# Altium project GanBasedSynchronousDCDCBuckConverter.PrjPcb
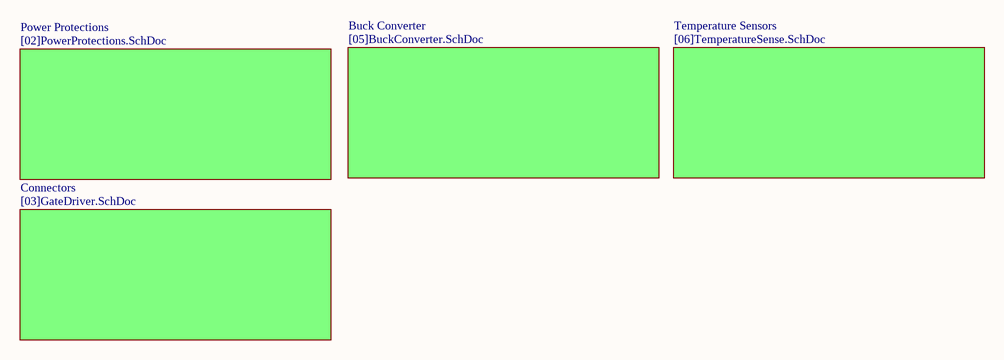
[diagram p0: [01]Main.SchDoc]
5 sheets, 56 parts. Net scope: flat (ports and power ports of the same name join across sheets).
Board file: BuckConverterDesign.PcbDoc
Sheets:
  [01]Main.SchDoc
    Power Protections = [02]PowerProtections.SchDoc
    Buck Converter = [05]BuckConverter.SchDoc
    Temperature Sensors = [06]TemperatureSense.SchDoc
    Connectors = [03]GateDriver.SchDoc

## Sheet [01]Main.SchDoc
size A4; SheetNumber: 1; SheetTotal: 5

### Sub-sheets
Buck Converter = [05]BuckConverter.SchDoc: no entries
Connectors = [03]GateDriver.SchDoc: no entries
Power Protections = [02]PowerProtections.SchDoc: no entries
Temperature Sensors = [06]TemperatureSense.SchDoc: no entries

### Notes on the sheet
- Title:
- Size:
- Date:
- A4
- Number:
- Time:
- Revision:
- Sheet
- of
- Project
- Drawn By :

## Sheet [02]PowerProtections.SchDoc
size A4; SheetNumber: 2; SheetTotal: 5
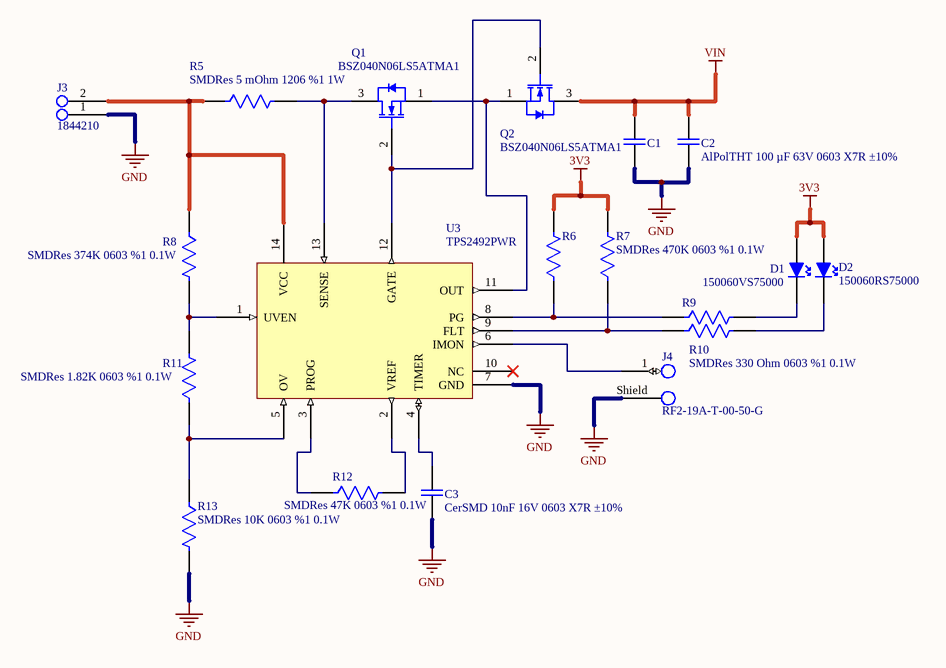
[diagram p1: [02]PowerProtections.SchDoc]

### Parts
C1  AlPolTHT 100 µF 63V 0603 X7R ±10%  [107AVG063MFBJ]  (value not drawn)
C2  AlPolTHT 100 µF 63V 0603 X7R ±10%  [107AVG063MFBJ]
C3  CerSMD 10nF 16V 0603 X7R ±10%  [CAPC1608X09N]
D1  150060VS75000  [LED1608X08N]
D2  150060RS75000  [LED1608X08N]
J3  1844210  [1844210]
J4  RF2-19A-T-00-50-G  [RF2-19A-T-00-50-G]
Q1  BSZ040N06LS5ATMA1  [PG-TSDSON-8-FL]
Q2  BSZ040N06LS5ATMA1  [PG-TSDSON-8-FL]
R5  SMDRes 5 mOhm 1206 %1 1W  [RESC3116X10N]
R6  SMDRes 470K 0603 %1 0.1W  [RESC1508X06N]  (value not drawn)
R7  SMDRes 470K 0603 %1 0.1W  [RESC1508X06N]
R8  SMDRes 374K 0603 %1 0.1W  [RESC1508X06N]
R9  MDRes 330 Ohm 0603 %1 0.1W  [RESC1508X06N]  (value not drawn)
R10  SMDRes 330 Ohm 0603 %1 0.1W  [RESC1508X06N]
R11  SMDRes 1.82K 0603 %1 0.1W  [RESC1508X06N]
R12  SMDRes 47K 0603 %1 0.1W  [RESC1508X06N]
R13  SMDRes 10K 0603 %1 0.1W  [RESC1508X06N]
U3  TPS2492PWR  [TSOP65P640X120-14L]

### Nets
3V3: D1.1(A) D2.1(A) R6.2 R7.2
GND: C1.2 C2.2 C3.2 J3.1 J4.Shield R13.2 U3.7(GND)
VIN: C1.1 C2.1 Q2.3(D)
NetC3_1: C3.1 U3.4(TIMER)
NetD1_2: D1.2(K) R9.2
NetD2_2: D2.2(K) R10.2
NetJ3_2: J3.2 R5.1 R8.1 U3.14(VCC)
NetJ4_1: J4.1 U3.6(IMON)
NetQ1_1: Q1.1(S) Q2.1(S) U3.11(OUT)
NetQ1_2: Q1.2(G) Q2.2(G) U3.12(GATE)
NetQ1_3: Q1.3(D) R5.2 U3.13(SENSE)
NetR6_1: R6.1 R9.1 U3.8(PG)
NetR7_1: R7.1 R10.1 U3.9(FLT)
NetR8_2: R8.2 R11.2 U3.1(UVEN)
NetR11_1: R11.1 R13.1 U3.5(OV)
NetR12_1: R12.1 U3.3(PROG)
NetR12_2: R12.2 U3.2(VREF)

Not connected (* = marked no-connect by the designer): U3 10(NC)*

### Notes on the sheet
- Title:
- Size:
- Date:
- A4
- Number:
- Time:
- Revision:
- Sheet
- of
- Project
- Drawn By :

### Library data of the parts
C1 C2 = CMP-00002-4: Ceramic Capacitor SMD 100 µF 63V 0603 X7R ±10%; Manufacturer: Cornell Dubilier Knowles; Digi-Key Part Number: 1572-1656-ND; Voltage: 63V; Mounting Type: Surface Mount; Tolerance: ±10%; Manufacturer Number: 107AVG063MFBJ; Package: 0603; Temperature Coefficient: X7R; Temperature: -55°C up to 125°C; Mouser Part Number: 598-107AVG063MFBJ
C3 = CMP-00001-3: Ceramic Capacitor SMD  10nF 16V 0603 X7R ±10%; Manufacturer Number: CL10B103KO8WPNC; Manufacturer: Samsung Electro-Mechanics; Digi-Key Part Number: 1276-CL10B103KO8WPNCCT-ND; Voltage: 16V; Mounting Type: Surface Mount; Temperature: -55°C up to 125°C; Tolerance: ±10%; Mouser Part Number: 187-CL10B103KO8WPNC; Package: 0603; Temperature Coefficient: X7R
D1 = CMP-00028-1: GREEN LED 0603
D2 = CMP-00024-1: RED LED 0603
J3 = CMP-00023-1: 12A 2-Pos, Right Angle
J4 = CMP-00025-2: Rf Sma Connector
Q1 Q2 = CMP-00004-1: N-MOS 60V 17A (Ta) 101A (Tc)
R5 = CMP-00007-2: 5 mOhms ±1% 1W Chip Resistor 1206 (3216 Metric) Automotive AEC-Q200, Current Sense, Moisture Resistant Metal Foil; Manufacturer Number: CSRF1206FT5L00; Manufacturer: Stackpole Electronics Inc; Temperature: -55°C up to 170°C; Digi-Key Part Number: CSRF1206FT5L00CT-ND; Tolerance: ±1%; Mouser Part Number: 708-CSRF1206FT5L00; Mounting Type: Surface Mount; Package: 1206; Power: 1W
R6 R7 = CMP-00006-1: Res Thick Film 0603 470K Ohm 1% 0.1W(1/10W) ±100ppm/C Pad SMD T/R Automotive AEC-Q200; Manufacturer: Stackpole Electronics Inc; Manufacturer Number: RMCF0603FT470K; Mouser Part Number: 708-RMCF0603FT470K; Power: 0.1W; Tolerance: ±1%; Digi-Key Part Number: RMCF0603FT470KCT-ND; Package: 0603; Mounting Type: Surface Mount; Temperature: -55°C up to 155°C
R8 = CMP-00005-2: Res Thick Film 0603 374K Ohm 1% 0.1W(1/10W) ±100ppm/C Pad SMD T/R Automotive AEC-Q200; Manufacturer: Stackpole Electronics Inc; Manufacturer Number: RMCF0603FT374K; Power: 0.1W; Temperature: -55°C up to 155°C; Mounting Type: Surface Mount; Package: 0603; Digi-Key Part Number: RMCF0603FT374KCT-ND; Mouser Part Number: 708-RMCF0603FT374K; Tolerance: ±1%
R9 R10 = CMP-00027-1: Res Thick Film 0603 33 kOhm Ohm 1% 0.1W(1/10W) ±100ppm/C Pad SMD T/R Automotive AEC-Q200; Manufacturer Number: RMCF0603FT330R; Manufacturer: Stackpole Electronics Inc; Mounting Type: Surface Mount; Mouser Part Number: 708-RMCF0603FT330R; Tolerance: ±1%; Digi-Key Part Number: RMCF0603FT330RCT-ND; Temperature: -55°C up to 155°C; Package: 0603; Power: 0.1W
R11 = CMP-00003-2: Res Thick Film 0603 1.82K Ohm 1% 0.1W(1/10W) ±100ppm/C Pad SMD T/R Automotive AEC-Q200; Manufacturer: Stackpole Electronics Inc; Manufacturer Number: RMCF0603FT1K82; Mouser Part Number: 708-RMCF0603FT1K82; Power: 0.1W; Package: 0603; Tolerance: ±1%; Mounting Type: Surface Mount; Digi-Key Part Number: RMCF0603FT1K82CT-ND; Temperature: -55°C up to 155°C
R12 = CMP-00008-1: Res Thick Film 0603 47K Ohm 1% 0.1W(1/10W) ±100ppm/C Pad SMD T/R Automotive AEC-Q200; Manufacturer Number: RMCF0603FT47K0; Manufacturer: Stackpole Electronics Inc; Power: 0.1W; Tolerance: ±1%; Mounting Type: Surface Mount; Temperature: -55°C up to 155°C; Digi-Key Part Number: RMCF0603FT47K0CT-ND; Mouser Part Number: 708-RMCF0603FT47K0; Package: 0603
R13 = CMP-00001-1-1: Res Thick Film 0603 10K Ohm 1% 0.1W(1/10W) ±100ppm/C Pad SMD T/R Automotive AEC-Q200; Manufacturer Number: RMCF0603FT10K0; Manufacturer: Stackpole Electronics Inc; Power: 0.1W; Mouser Part Number: 708-RMCF0603FT10K0; Tolerance: ±1%; Package: 0603; Mounting Type: Surface Mount; Digi-Key Part Number: RMCF0603FT10K0CT-ND; Temperature: -55°C up to 155°C
U3 = CMP-00000-2: eFuses - External MOSFETs - 9V-80V; Manufacturer: Texas Instruments; Temperature Rating: -40°C up to 125°C; Voltage Rating: 9V up to 80V; Internal Switch(s): No; Features: Adjustable Current Limit, Adjustable Soft Start, Current Monitoring, Fault Output, Overcurrent Protection, Overvoltage Protection, Power Good Signal, Short Circuit Protection, Adjustable UVLO; Package: 14-TSSOP; Manufacturer Number: TPS2492PWR; Mouser Part Number: 595-TPS2492PWR; Mount Type: Surface Mount; Digi-Key Part Number: 296-39373-1-ND

## Sheet [05]BuckConverter.SchDoc
size A4; SheetNumber: 4; SheetTotal: 5
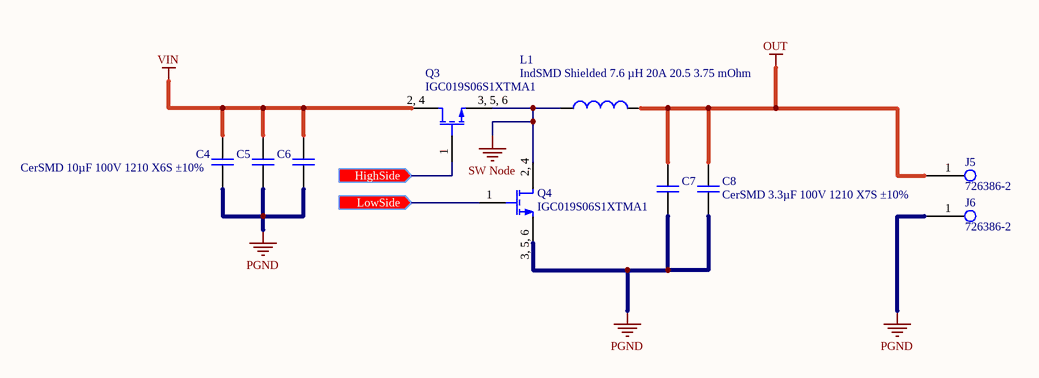
[diagram p2: [05]BuckConverter.SchDoc]

### Parts
C4  CerSMD 10µF 100V 1210 X6S ±10%  [CAPC3216X18N]
C5  CerSMD 10µF 100V 1210 X6S ±10%  [CAPC3216X18N]  (value not drawn)
C6  CerSMD 10µF 100V 1210 X6S ±10%  [CAPC3216X18N]  (value not drawn)
C7  CerSMD 3.3µF 100V 1210 X7S ±10%  [CAPC3225X28N]  (value not drawn)
C8  CerSMD 3.3µF 100V 1210 X7S ±10%  [CAPC3225X28N]
J5  726386-2  [1844210]
J6  726386-2  [1844210]
L1  IndSMD Shielded 7.6 µH 20A 20.5 3.75 mOhm  [7443557760]
Q3  IGC019S06S1XTMA1  [IGC019S06S1XTMA1]
Q4  IGC019S06S1XTMA1  [IGC019S06S1XTMA1]

### Ports
HighSide (in, see [03]GateDriver[3B]), LowSide (in, see [03]GateDriver[3C])

### Nets
OUT: C7.1 C8.1 J5.1 L1.2
PGND: C4.2 C5.2 C6.2 C7.2 C8.2 J6.1 Q4.3,_5,_6(S)
SW Node: L1.1 Q3.3,_5,_6(S) Q4.2,_4(D)
VIN: C4.1 C5.1 C6.1 Q3.2,_4(D)
NetQ3_1: Q3.1(G) ; port HighSide
NetQ4_1: Q4.1(G) ; port LowSide

### Notes on the sheet
- Title:
- Size:
- Date:
- A4
- Number:
- Time:
- Revision:
- Sheet
- of
- Project
- Drawn By :

### Library data of the parts
C4-C6 = CMP-000078-1: Ceramic Capacitor SMD 10µF 100V 1210 X6S ±10%; Manufacturer: TDK Corporation; Manufacturer Number: C3216X6S2A106K160AC; Temperature Coefficient: X7R; Voltage: 16V; Mounting Type: Surface Mount; Digi-Key Part Number: C3216X6S2A106K160AC; Tolerance: ±10%; Farnell Number: 4066660; Package: 0603; Temperature: -55°C up to 125°C; Mouser Part Number: 810-C3216X6S2A106K16
C7 C8 = CMP-00010-1: Ceramic Capacitor SMD 3.3µF 100V 1210 X7S ±10%; Manufacturer: Samsung Electro-Mechanics; Manufacturer Number: C3225X7S2A335K200AB; Voltage: 16V; Temperature Coefficient: X7R; Farnell Number: 2476113; Digi-Key Part Number: 445-5209-1-ND; Temperature: -55°C up to 125°C; Tolerance: ±10%; Mounting Type: Surface Mount; Package: 0603; Mouser Part Number: 810-C3225X7S2A335K
J5 J6 = CMP-00026-1
L1 = CMP-00011-1: Inductor SMD Shielded 7.6 µH 20A 20.5 3.75 mOhm
Q3 Q4 = CMP-00009-5: GaNFET N-Ch - 60V - 27A (Ta), 99A (Tc); Manufacturer: Infineon Technologies; Vgs(max): ±6.5V; Rdson: 1.9mOhm; Vgs(th): 2.9V; Drive Voltage: 5V; FET Type: N-Channel; Package: PG-TSON-6-2; Mouser Part Number: 726-IGC019S06S1XTMA1; Digi-Key Part Number: 448-IGC019S06S1XTMA1CT-ND; Farnell Part Number: 4680815; Manufacturer Number: IGC019S06S1XTMA1; Vdss: 60V; Ids: 27A (Ta), 99A (Tc); Mounting Type: Surface Mount; Operating Temperature: -40°C up to 150°C (TJ)

## Sheet [06]TemperatureSense.SchDoc
size A4; SheetNumber: 5; SheetTotal: 5
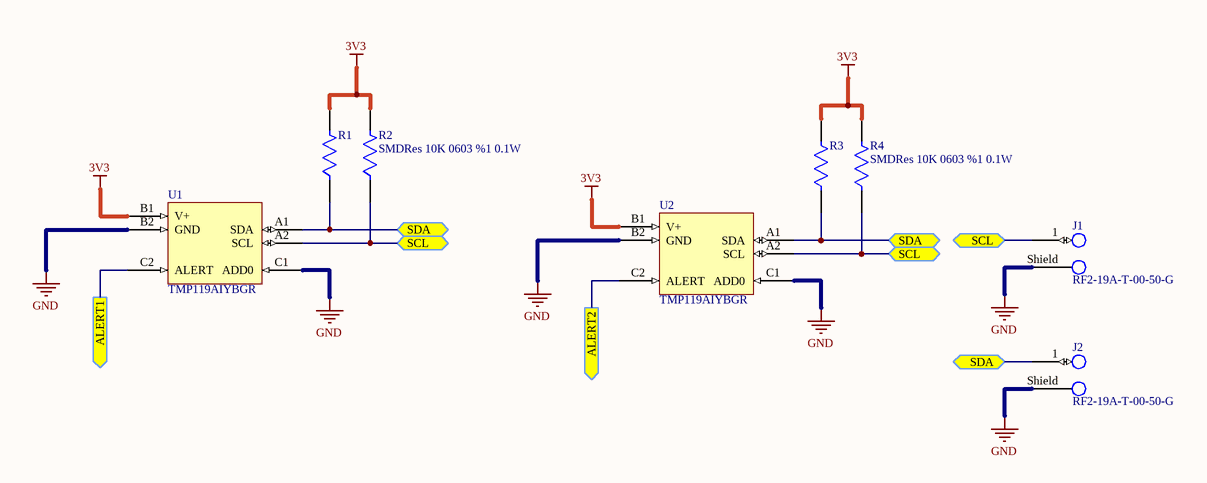
[diagram p3: [06]TemperatureSense.SchDoc]

### Parts
J1  RF2-19A-T-00-50-G  [RF2-19A-T-00-50-G]
J2  RF2-19A-T-00-50-G  [RF2-19A-T-00-50-G]
R1  SMDRes 10K 0603 %1 0.1W  [RESC1508X06N]  (value not drawn)
R2  SMDRes 10K 0603 %1 0.1W  [RESC1508X06N]
R3  SMDRes 10K 0603 %1 0.1W  [RESC1508X06N]  (value not drawn)
R4  SMDRes 10K 0603 %1 0.1W  [RESC1508X06N]
U1  TMP119AIYBGR  [BGA6C40P2X3_95X149X52]
U2  TMP119AIYBGR  [BGA6C40P2X3_95X149X52]

### Ports
ALERT1 (out), ALERT2 (out), SCL (bidir, see [06]TemperatureSense[2C], [06]TemperatureSense[4C]), SCL (bidir, see [06]TemperatureSense[4C]), SDA (bidir, see [06]TemperatureSense[2B], [06]TemperatureSense[4C]), SDA (bidir, see [06]TemperatureSense[4C])

### Nets
3V3: R1.2 R2.2 R3.2 R4.2 U1.B1(V+) U2.B1(V+)
GND: J1.Shield J2.Shield U1.B2(GND) U1.C1(ADD0) U2.B2(GND) U2.C1(ADD0)
NetJ1_1: J1.1 R2.1 R4.1 U1.A2(SCL) U2.A2(SCL) ; port SCL
NetJ2_1: J2.1 R1.1 R3.1 U1.A1(SDA) U2.A1(SDA) ; port SDA
NetU1_C2: U1.C2(ALERT) ; port ALERT1
NetU2_C2: U2.C2(ALERT) ; port ALERT2

### Notes on the sheet
- Title:
- Size:
- Date:
- A4
- Number:
- Time:
- Revision:
- Sheet
- of
- Project
- Drawn By :

### Library data of the parts
J1 J2 = CMP-00025-2: Rf Sma Connector
R1-R4 = CMP-00001-1-2: Res Thick Film 0603 10K Ohm 1% 0.1W(1/10W) ±100ppm/C Pad SMD T/R Automotive AEC-Q200; Manufacturer Number: RMCF0603FT10K0; Manufacturer: Stackpole Electronics Inc; Power: 0.1W; Mounting Type: Surface Mount; Temperature: -55°C up to 155°C; Digi-Key Part Number: RMCF0603FT10K0CT-ND; Tolerance: ±1%; Package: 0603; Mouser Part Number: 708-RMCF0603FT10K0
U1 U2 = CMP-00021-1: Temperature Sensor

## Sheet [03]GateDriver.SchDoc
size A4; SheetNumber: 3; SheetTotal: 5
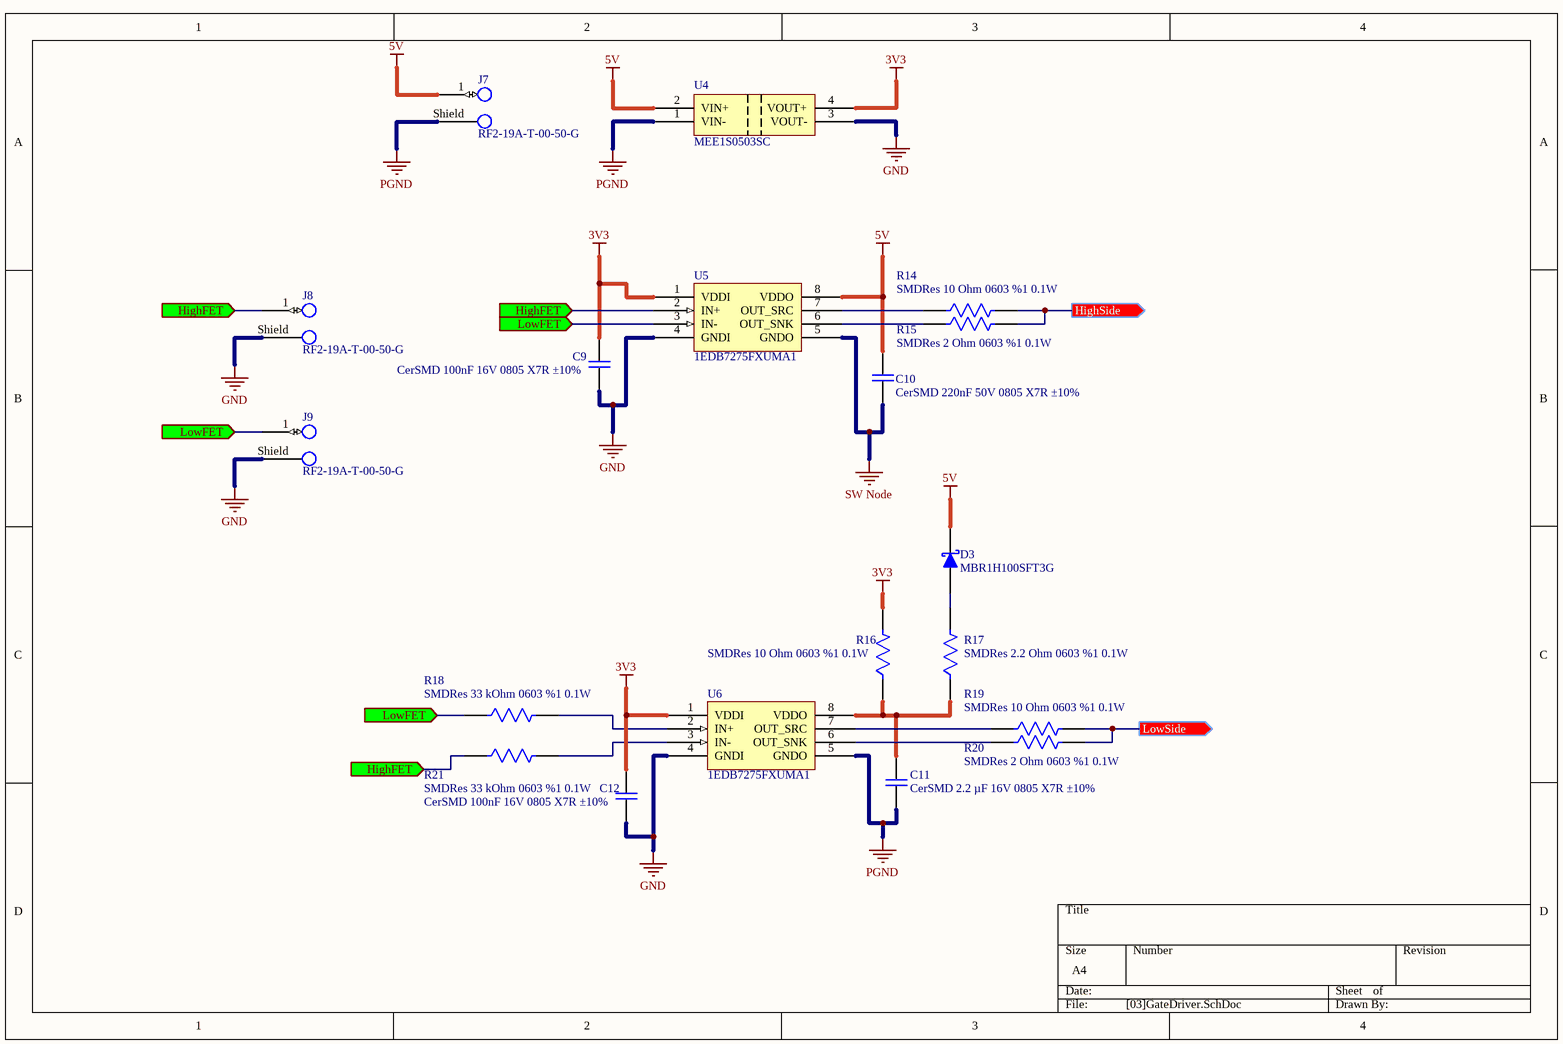
[diagram p4: [03]GateDriver.SchDoc]

### Parts
C9  CerSMD 100nF 16V 0805 X7R ±10%  [CAPC2012X09N]
C10  CerSMD 220nF 50V 0805 X7R ±10%  [CAPC2012X09N]
C11  CerSMD 2.2 µF 16V 0805 X7R ±10%  [CAPC2012X09N]
C12  CerSMD 100nF 16V 0805 X7R ±10%  [CAPC2012X09N]
D3  MBR1H100SFT3G  [SODFL360X95-2N]
J7  RF2-19A-T-00-50-G  [RF2-19A-T-00-50-G]
J8  RF2-19A-T-00-50-G  [RF2-19A-T-00-50-G]
J9  RF2-19A-T-00-50-G  [RF2-19A-T-00-50-G]
R14  SMDRes 10 Ohm 0603 %1 0.1W  [RESC1508X06N]
R15  SMDRes 2 Ohm 0603 %1 0.1W  [RESC1508X06N]
R16  SMDRes 10 Ohm 0603 %1 0.1W  [RESC1508X06N]
R17  SMDRes 2.2 Ohm 0603 %1 0.1W  [RESC1508X06N]
R18  SMDRes 33 kOhm 0603 %1 0.1W  [RESC1508X06N]
R19  SMDRes 10 Ohm 0603 %1 0.1W  [RESC1508X06N]
R20  SMDRes 2 Ohm 0603 %1 0.1W  [RESC1508X06N]
R21  SMDRes 33 kOhm 0603 %1 0.1W  [RESC1508X06N]
U4  MEE1S0503SC  [MEE1S0503SC-Footprint-1]
U5  1EDB7275FXUMA1  [SOIC127P600X175-8N]
U6  1EDB7275FXUMA1  [SOIC127P600X175-8N]

### Ports
HighFET (in, see [03]GateDriver[1B], [03]GateDriver[1C]), HighFET (in, see [03]GateDriver[1B], [03]GateDriver[2B]), HighFET (in, see [03]GateDriver[1C], [03]GateDriver[2B]), HighSide (out, see [05]BuckConverter[2B]), LowFET (in, see [03]GateDriver[1B], [03]GateDriver[1C]), LowFET (in, see [03]GateDriver[1B], [03]GateDriver[2B]), LowFET (in, see [03]GateDriver[1C], [03]GateDriver[2B]), LowSide (out, see [05]BuckConverter[2C])

### Nets
3V3: C9.1 C12.1 R16.2 U4.4(VOUT+) U5.1(VDDI) U6.1(VDDI)
5V: C10.1 D3.2(K) J7.1 U4.2(VIN+) U5.8(VDDO)
GND: C9.2 C12.2 J8.Shield J9.Shield U4.3(VOUT-) U5.4(GNDI) U6.4(GNDI)
PGND: C11.2 J7.Shield U4.1(VIN-) U6.5(GNDO)
SW Node: C10.2 U5.5(GNDO)
NetC11_1: C11.1 R16.1 R17.1 U6.8(VDDO)
NetD3_1: D3.1(A) R17.2
NetJ8_1: J8.1 R21.1 U5.2(IN+) ; port HighFET
NetJ9_1: J9.1 R18.1 U5.3(IN-) ; port LowFET
NetQ3_1: R14.2 R15.2 ; port HighSide
NetQ4_1: R19.2 R20.2 ; port LowSide
NetR14_1: R14.1 U5.7(OUT_SRC)
NetR15_1: R15.1 U5.6(OUT_SNK)
NetR18_2: R18.2 U6.2(IN+)
NetR19_1: R19.1 U6.7(OUT_SRC)
NetR20_1: R20.1 U6.6(OUT_SNK)
NetR21_2: R21.2 U6.3(IN-)

### Library data of the parts
C9 C12 = CMP-00013-1: Ceramic Capacitor SMD 100nF 10V 0805 X7R ±10%; Manufacturer Number: 885012207016; Manufacturer: Würth Elektronik; Temperature Coefficient: X7R; Mounting Type: Surface Mount; Package: 0603; Mouser Part Number: 710-885012207016; Voltage: 10V; Tolerance: ±10%; Temperature: -55°C up to 125°C; Digi-Key Part Number: 732-8026-1-ND; Farnell Part Number: 2534051
C10 = CMP-00016-1: Ceramic Capacitor SMD 220nF 50V 0805 X7R ±10%; Manufacturer: Murata Electronics; Manufacturer Number: GRM21BR71H224KA01L; Voltage: 10V; Tolerance: ±10%; Package: 0805; Mounting Type: Surface Mount; Mouser Part Number: 81-GRM40X7R224K050AL; Digi-Key Part Number: 490-1670-1-ND; Temperature: -55°C up to 125°C; Temperature Coefficient: X7R
C11 = CMP-00014-1: Ceramic Capacitor SMD 2.2 µF 16V 0805 X7R ±10%; Manufacturer Number: C2012X7R1C225K125AB; Manufacturer: TDK Corporation; Farnell Part Number: 1907345; Temperature Coefficient: X7R; Digi-Key Part Number: 445-1420-1-ND; Mounting Type: Surface Mount; Tolerance: ±10%; Package: 0805; Voltage: 16V; Mouser Part Number: 810-C2012X7R1C225K; Temperature: -55°C up to 125°C
D3 = CMP-00020-2
J7-J9 = CMP-00025-2: Rf Sma Connector
R14 R16 R19 = CMP-00017-1: Res Thick Film 0603 10 Ohm Ohm 1% 0.1W(1/10W) ±100ppm/C Pad SMD T/R Automotive AEC-Q200; Manufacturer Number: RMCF0603FT10R0; Manufacturer: Stackpole Electronics Inc; Package: 0603; Digi-Key Part Number: RMCF0603FT10R0CT-ND; Mouser Part Number: 708-RMCF0603FT10R0; Power: 0.1W; Mounting Type: Surface Mount; Temperature: -55°C up to 155°C; Tolerance: ±1%
R15 R20 = CMP-00019-1: Res Thick Film 0603 2 Ohm Ohm 1% 0.1W(1/10W) ±100ppm/C Pad SMD T/R Automotive AEC-Q200; Manufacturer: Stackpole Electronics Inc; Manufacturer Number: RMCF0603FT2R00; Mounting Type: Surface Mount; Power: 0.1W; Tolerance: ±1%; Package: 0603; Mouser Part Number: 708-RMCF0603FT2R00; Temperature: -55°C up to 155°C; Digi-Key Part Number: RMCF0603FT2R00CT-ND
R17 = CMP-00015-1: Res Thick Film 0603 2.2 Ohm Ohm 1% 0.1W(1/10W) ±100ppm/C Pad SMD T/R Automotive AEC-Q200; Manufacturer Number: RMCF0603FT2R20; Manufacturer: Stackpole Electronics Inc; Mouser Part Number: 708-RMCF0603FT2R20; Power: 0.1W; Tolerance: ±1%; Package: 0603; Temperature: -55°C up to 155°C; Digi-Key Part Number: RMCF0603FT2R20CT-ND; Mounting Type: Surface Mount
R18 R21 = CMP-00018-1: Res Thick Film 0603 33 kOhm Ohm 1% 0.1W(1/10W) ±100ppm/C Pad SMD T/R Automotive AEC-Q200; Manufacturer: Stackpole Electronics Inc; Manufacturer Number: RMCF0603FT33K0; Package: 0603; Tolerance: ±1%; Digi-Key Part Number: RMCF0603FT33K0CT-ND; Power: 0.1W; Temperature: -55°C up to 155°C; Mouser Part Number: 708-RMCF0603FT33K0; Mounting Type: Surface Mount
U4 = CMP-00029-1: Murata Power - 5V to 3.3V Isolated DC-DC Converter 1W
U5 U6 = CMP-00012-1

## Nets that join several sheets
3V3: [02]PowerProtections (D1.1 D2.1 R6.2 R7.2), [06]TemperatureSense (6 pins), [03]GateDriver (6 pins)
GND: [02]PowerProtections (7 pins), [06]TemperatureSense (6 pins), [03]GateDriver (7 pins)
PGND: [05]BuckConverter (7 pins), [03]GateDriver (C11.2 J7.Shield U4.1 U6.5)
SW Node: [05]BuckConverter (L1.1 Q3.3, 5, 6 Q4.2, 4), [03]GateDriver (C10.2 U5.5)
VIN: [02]PowerProtections (C1.1 C2.1 Q2.3), [05]BuckConverter (C4.1 C5.1 C6.1 Q3.2, 4)
NetQ3_1: [05]BuckConverter (Q3.1), [03]GateDriver (R14.2 R15.2)
NetQ4_1: [05]BuckConverter (Q4.1), [03]GateDriver (R19.2 R20.2)